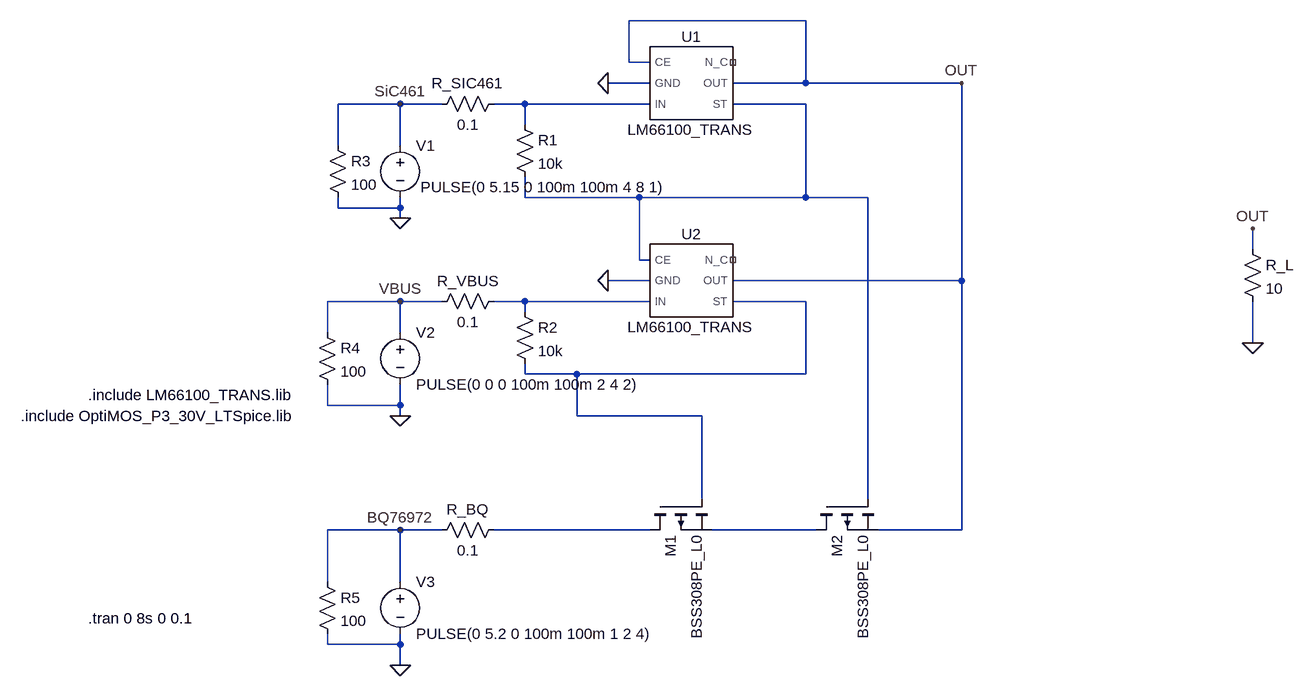
[diagram p0: schematic 5vORing.asc]
5vORing.asc, the LTspice schematic file:
Version 4
SHEET 1 1336 1092
WIRE 432 80 160 80
WIRE 160 144 160 80
WIRE 192 144 160 144
WIRE 192 176 128 176
WIRE 432 176 432 80
WIRE 432 176 320 176
WIRE 672 176 432 176
WIRE -192 208 -288 208
WIRE -128 208 -192 208
WIRE 0 208 -48 208
WIRE 192 208 0 208
WIRE 432 208 320 208
WIRE 0 240 0 208
WIRE -288 272 -288 208
WIRE -192 272 -192 208
WIRE 0 352 0 320
WIRE 176 352 0 352
WIRE 432 352 432 208
WIRE 432 352 176 352
WIRE 528 352 432 352
WIRE -288 368 -288 352
WIRE -192 368 -192 352
WIRE -192 368 -288 368
WIRE -192 384 -192 368
WIRE 1120 432 1120 400
WIRE 176 448 176 352
WIRE 192 448 176 448
WIRE 192 480 128 480
WIRE 672 480 672 176
WIRE 672 480 320 480
WIRE -192 512 -304 512
WIRE -128 512 -192 512
WIRE 0 512 -48 512
WIRE 192 512 0 512
WIRE 432 512 320 512
WIRE 0 528 0 512
WIRE -304 560 -304 512
WIRE -192 560 -192 512
WIRE 1120 576 1120 512
WIRE 0 624 0 608
WIRE 80 624 0 624
WIRE 432 624 432 512
WIRE 432 624 80 624
WIRE -304 672 -304 640
WIRE -192 672 -192 640
WIRE -192 672 -304 672
WIRE -192 688 -192 672
WIRE 80 688 80 624
WIRE 272 688 80 688
WIRE 272 816 272 688
WIRE 528 816 528 352
WIRE -192 864 -304 864
WIRE -128 864 -192 864
WIRE 192 864 -48 864
WIRE 448 864 288 864
WIRE 672 864 672 480
WIRE 672 864 544 864
WIRE -304 944 -304 864
WIRE -192 944 -192 864
WIRE -304 1040 -304 1024
WIRE -192 1040 -192 1024
WIRE -192 1040 -304 1040
WIRE -192 1072 -192 1040
FLAG -192 384 0
FLAG -192 1072 0
FLAG -192 688 0
FLAG 128 176 0
FLAG 128 480 0
FLAG 672 176 OUT
FLAG 1120 400 OUT
FLAG 1120 576 0
FLAG -192 208 SiC461
FLAG -192 512 VBUS
FLAG -192 864 BQ76972
SYMBOL AutoGenerated\\LM66100_TRANS 256 176 R0
SYMATTR InstName U1
SYMBOL voltage -192 256 R0
WINDOW 3 31 80 Left 2
WINDOW 123 0 0 Left 0
WINDOW 39 0 0 Left 0
SYMATTR Value PULSE(0 5.15 0 100m 100m 4 8 1)
SYMATTR InstName V1
SYMBOL voltage -192 544 R0
WINDOW 123 0 0 Left 0
WINDOW 39 0 0 Left 0
SYMATTR InstName V2
SYMATTR Value PULSE(0 0 0 100m 100m 2 4 2)
SYMBOL voltage -192 928 R0
WINDOW 123 0 0 Left 0
WINDOW 39 0 0 Left 0
SYMATTR InstName V3
SYMATTR Value PULSE(0 5.2 0 100m 100m 1 2 4)
SYMBOL AutoGenerated\\LM66100_TRANS 256 480 R0
SYMATTR InstName U2
SYMBOL res -16 224 R0
SYMATTR InstName R1
SYMATTR Value 10k
SYMBOL res -16 512 R0
SYMATTR InstName R2
SYMATTR Value 10k
SYMBOL res 1104 416 R0
SYMATTR InstName R_L
SYMATTR Value 10
SYMBOL res -304 256 R0
SYMATTR InstName R3
SYMATTR Value 100
SYMBOL res -320 544 R0
SYMATTR InstName R4
SYMATTR Value 100
SYMBOL res -320 928 R0
SYMATTR InstName R5
SYMATTR Value 100
SYMBOL res -32 192 R90
WINDOW 0 0 56 VBottom 2
WINDOW 3 32 56 VTop 2
SYMATTR InstName R_SIC461
SYMATTR Value 0.1
SYMBOL res -32 496 R90
WINDOW 0 0 56 VBottom 2
WINDOW 3 32 56 VTop 2
SYMATTR InstName R_VBUS
SYMATTR Value 0.1
SYMBOL res -32 848 R90
WINDOW 0 0 56 VBottom 2
WINDOW 3 32 56 VTop 2
SYMATTR InstName R_BQ
SYMATTR Value 0.1
SYMBOL pmos 192 816 M90
SYMATTR InstName M1
SYMATTR Value BSS308PE_L0
SYMATTR Prefix X
SYMBOL pmos 448 816 M90
SYMATTR InstName M2
SYMATTR Value BSS308PE_L0
SYMATTR Prefix X
TEXT -672 656 Left 2 !.include LM66100_TRANS.lib
TEXT -672 1000 Left 2 !.tran 0 8s 0 0.1
TEXT -776 688 Left 2 !.include OptiMOS_P3_30V_LTSpice.lib

The netlist it stands for:
* 5vORing.asc
XU1 OUT 0 N001 NC_01 OUT N002 LM66100_TRANS  ; pins CE GND IN N_C OUT ST
V1 SiC461 0 PULSE(0 5.15 0 100m 100m 4 8 1)
V2 VBUS 0 PULSE(0 0 0 100m 100m 2 4 2)
V3 BQ76972 0 PULSE(0 5.2 0 100m 100m 1 2 4)
XU2 N002 0 N003 NC_02 OUT N004 LM66100_TRANS  ; pins CE GND IN N_C OUT ST
R1 N001 N002 10k
R2 N003 N004 10k
R_L OUT 0 10
R3 SiC461 0 100
R4 VBUS 0 100
R5 BQ76972 0 100
R_SIC461 N001 SiC461 0.1
R_VBUS N003 VBUS 0.1
R_BQ N005 BQ76972 0.1
XM1 N005 N004 N006 BSS308PE_L0  ; pins D G S
XM2 N006 N002 OUT BSS308PE_L0  ; pins D G S
.include LM66100_TRANS.lib
.tran 0 8s 0 0.1
.include OptiMOS_P3_30V_LTSpice.lib
.lib C:\Users\matth\Downloads\slvmd40b\LM66100_PSPICE_TRANS\LM66100_TRANS.lib
.backanno
.end